# Altium schematic sheet INMP441-SMD-FOOTPRINT_2025-12-07.schdoc
size 57 x 30 mm
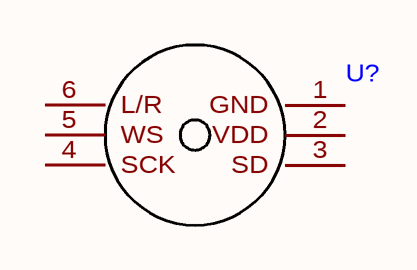
[diagram p0: INMP441-SMD-FOOTPRINT_2025-12-07.schdoc]

## Parts
U?  (no value)  [INMP441_OMNIDIRECTIONAL_MICROPHONE_MODULE]

## Nets

Not connected (* = marked no-connect by the designer): U? 1(GND) 2(VDD) 3(SD) 4(SCK) 5(WS) 6(L/R)

## Library data of the parts
U? = INMP441-SMD FOOTPRINT